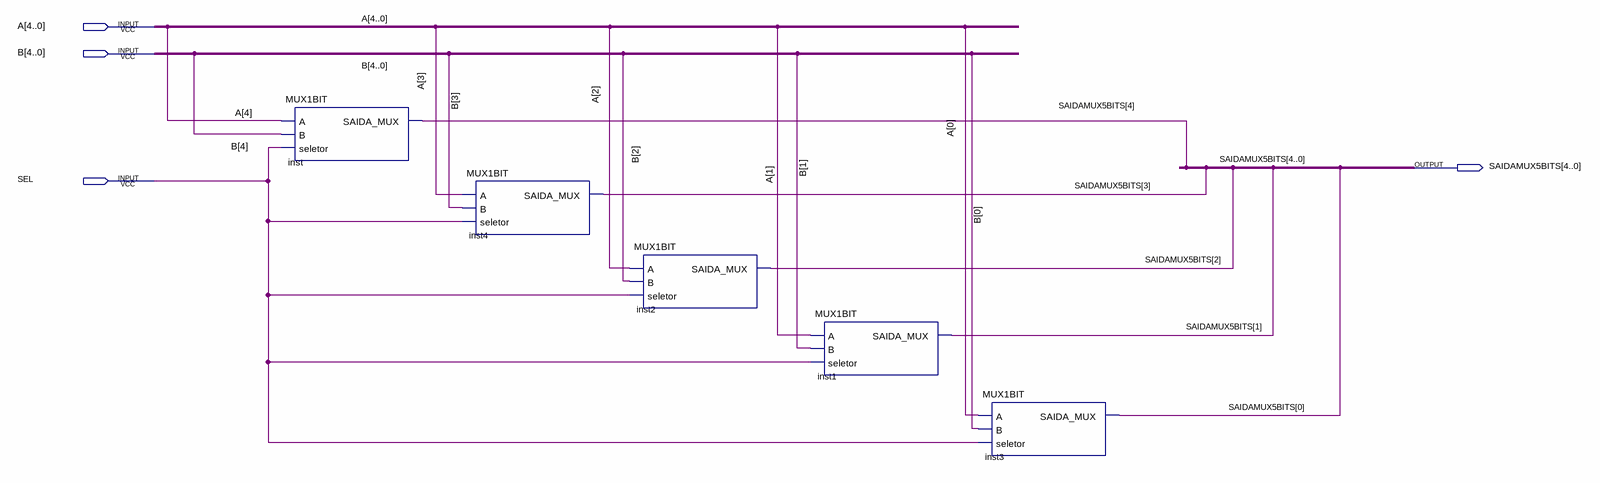
[diagram p0: schematic sheet]
// Quartus schematic MUX5BITS.bdf as structural Verilog: 5 symbols, 4 pins
module MUX5BITS (
  input  [4:0] A,
  input  [4:0] B,
  input  SEL,
  output [4:0] SAIDAMUX5BITS
);

  MUX1BIT inst (.A(A[4]), .B(B[4]), .seletor(SEL), .SAIDA_MUX(SAIDAMUX5BITS[4]));
  MUX1BIT inst4 (.A(A[3]), .B(B[3]), .seletor(SEL), .SAIDA_MUX(SAIDAMUX5BITS[3]));
  MUX1BIT inst2 (.A(A[2]), .B(B[2]), .seletor(SEL), .SAIDA_MUX(SAIDAMUX5BITS[2]));
  MUX1BIT inst1 (.A(A[1]), .B(B[1]), .seletor(SEL), .SAIDA_MUX(SAIDAMUX5BITS[1]));
  MUX1BIT inst3 (.A(A[0]), .B(B[0]), .seletor(SEL), .SAIDA_MUX(SAIDAMUX5BITS[0]));
endmodule
